# Altium schematic sheet SiP_sensors.SchDoc: Magic Baton: SiP Sensor Connections
size Letter
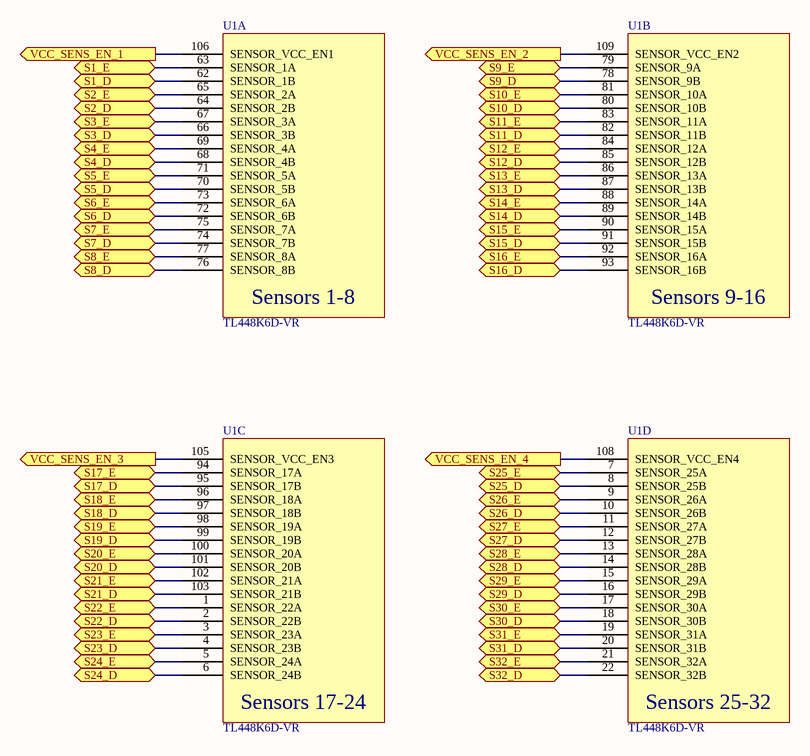
[diagram p0: SiP_sensors.SchDoc]

## Parts
U1  TL448K6D-VR  [WatchmanModule_v4]  (parts A,B,C,D of 7)

## Ports
S1_D (bidir), S1_E (bidir), S2_D (bidir), S2_E (bidir), S3_D (bidir), S3_E (bidir), S4_D (bidir), S4_E (bidir), S5_D (bidir), S5_E (bidir), S6_D (bidir), S6_E (bidir), S7_D (bidir), S7_E (bidir), S8_D (bidir), S8_E (bidir), S9_D (bidir), S9_E (bidir), S10_D (bidir), S10_E (bidir), S11_D (bidir), S11_E (bidir), S12_D (bidir), S12_E (bidir), S13_D (bidir), S13_E (bidir), S14_D (bidir), S14_E (bidir), S15_D (bidir), S15_E (bidir), S16_D (bidir), S16_E (bidir), S17_D (bidir), S17_E (bidir), S18_D (bidir), S18_E (bidir), S19_D (bidir), S19_E (bidir), S20_D (bidir), S20_E (bidir), S21_D (bidir), S21_E (bidir), S22_D (bidir), S22_E (bidir), S23_D (bidir), S23_E (bidir), S24_D (bidir), S24_E (bidir), S25_D (bidir), S25_E (bidir), S26_D (bidir), S26_E (bidir), S27_D (bidir), S27_E (bidir), S28_D (bidir), S28_E (bidir), S29_D (bidir), S29_E (bidir), S30_D (bidir), S30_E (bidir), S31_D (bidir), S31_E (bidir), S32_D (bidir), S32_E (bidir), VCC_SENS_EN_1 (out), VCC_SENS_EN_2 (out), VCC_SENS_EN_3 (out), VCC_SENS_EN_4 (out)

## Nets
S1_D: U1.62(SENSOR_1B) ; port S1_D
S1_E: U1.63(SENSOR_1A) ; port S1_E
S2_D: U1.64(SENSOR_2B) ; port S2_D
S2_E: U1.65(SENSOR_2A) ; port S2_E
S3_D: U1.66(SENSOR_3B) ; port S3_D
S3_E: U1.67(SENSOR_3A) ; port S3_E
S4_D: U1.68(SENSOR_4B) ; port S4_D
S4_E: U1.69(SENSOR_4A) ; port S4_E
S5_D: U1.70(SENSOR_5B) ; port S5_D
S5_E: U1.71(SENSOR_5A) ; port S5_E
S6_D: U1.72(SENSOR_6B) ; port S6_D
S6_E: U1.73(SENSOR_6A) ; port S6_E
S7_D: U1.74(SENSOR_7B) ; port S7_D
S7_E: U1.75(SENSOR_7A) ; port S7_E
S8_D: U1.76(SENSOR_8B) ; port S8_D
S8_E: U1.77(SENSOR_8A) ; port S8_E
S9_D: U1.78(SENSOR_9B) ; port S9_D
S9_E: U1.79(SENSOR_9A) ; port S9_E
S10_D: U1.80(SENSOR_10B) ; port S10_D
S10_E: U1.81(SENSOR_10A) ; port S10_E
S11_D: U1.82(SENSOR_11B) ; port S11_D
S11_E: U1.83(SENSOR_11A) ; port S11_E
S12_D: U1.85(SENSOR_12B) ; port S12_D
S12_E: U1.84(SENSOR_12A) ; port S12_E
S13_D: U1.87(SENSOR_13B) ; port S13_D
S13_E: U1.86(SENSOR_13A) ; port S13_E
S14_D: U1.89(SENSOR_14B) ; port S14_D
S14_E: U1.88(SENSOR_14A) ; port S14_E
S15_D: U1.91(SENSOR_15B) ; port S15_D
S15_E: U1.90(SENSOR_15A) ; port S15_E
S16_D: U1.93(SENSOR_16B) ; port S16_D
S16_E: U1.92(SENSOR_16A) ; port S16_E
S17_D: U1.95(SENSOR_17B) ; port S17_D
S17_E: U1.94(SENSOR_17A) ; port S17_E
S18_D: U1.97(SENSOR_18B) ; port S18_D
S18_E: U1.96(SENSOR_18A) ; port S18_E
S19_D: U1.99(SENSOR_19B) ; port S19_D
S19_E: U1.98(SENSOR_19A) ; port S19_E
S20_D: U1.101(SENSOR_20B) ; port S20_D
S20_E: U1.100(SENSOR_20A) ; port S20_E
S21_D: U1.103(SENSOR_21B) ; port S21_D
S21_E: U1.102(SENSOR_21A) ; port S21_E
S22_D: U1.2(SENSOR_22B) ; port S22_D
S22_E: U1.1(SENSOR_22A) ; port S22_E
S23_D: U1.4(SENSOR_23B) ; port S23_D
S23_E: U1.3(SENSOR_23A) ; port S23_E
S24_D: U1.6(SENSOR_24B) ; port S24_D
S24_E: U1.5(SENSOR_24A) ; port S24_E
S25_D: U1.8(SENSOR_25B) ; port S25_D
S25_E: U1.7(SENSOR_25A) ; port S25_E
S26_D: U1.10(SENSOR_26B) ; port S26_D
S26_E: U1.9(SENSOR_26A) ; port S26_E
S27_D: U1.12(SENSOR_27B) ; port S27_D
S27_E: U1.11(SENSOR_27A) ; port S27_E
S28_D: U1.14(SENSOR_28B) ; port S28_D
S28_E: U1.13(SENSOR_28A) ; port S28_E
S29_D: U1.16(SENSOR_29B) ; port S29_D
S29_E: U1.15(SENSOR_29A) ; port S29_E
S30_D: U1.18(SENSOR_30B) ; port S30_D
S30_E: U1.17(SENSOR_30A) ; port S30_E
S31_D: U1.20(SENSOR_31B) ; port S31_D
S31_E: U1.19(SENSOR_31A) ; port S31_E
S32_D: U1.22(SENSOR_32B) ; port S32_D
S32_E: U1.21(SENSOR_32A) ; port S32_E
VCC_SENS_EN_1: U1.106(SENSOR_VCC_EN1) ; port VCC_SENS_EN_1
VCC_SENS_EN_2: U1.109(SENSOR_VCC_EN2) ; port VCC_SENS_EN_2
VCC_SENS_EN_3: U1.105(SENSOR_VCC_EN3) ; port VCC_SENS_EN_3
VCC_SENS_EN_4: U1.108(SENSOR_VCC_EN4) ; port VCC_SENS_EN_4

## Notes on the sheet
- Title
- Size:
- Date:
- Letter
- Number:
- Time:
- Revision:
- Sheet
- of
- File:
- (in symbol TL448K6D-VR, part A) Sensors 1-8
- (in symbol TL448K6D-VR, part B) Sensors 9-16
- (in symbol TL448K6D-VR, part C) Sensors 17-24
- (in symbol TL448K6D-VR, part D) Sensors 25-32